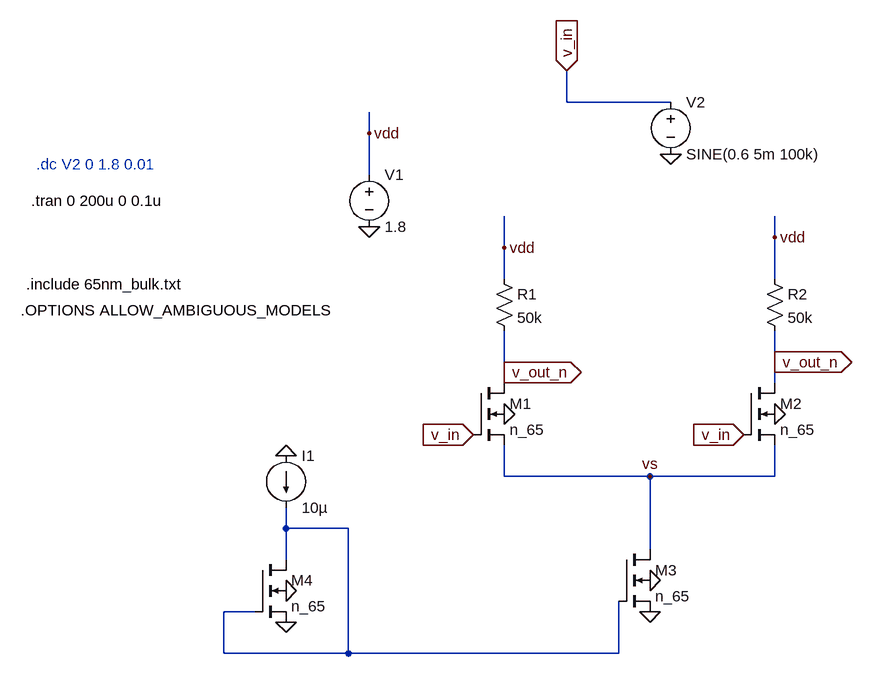
[diagram p0: schematic DiffAMPcommonmode1.asc]
DiffAMPcommonmode1.asc, the LTspice schematic file:
Version 4.1
SHEET 1 880 680
WIRE 288 -272 288 -320
WIRE 448 -272 288 -272
WIRE -16 -224 -16 -256
WIRE -16 -160 -16 -224
WIRE 608 -64 608 -96
WIRE 192 -48 192 -96
WIRE 192 0 192 -48
WIRE 608 0 608 -64
WIRE 608 128 608 80
WIRE 192 144 192 80
WIRE 192 160 192 144
WIRE 608 160 608 128
WIRE 192 304 192 256
WIRE 416 304 192 304
WIRE 608 304 608 256
WIRE 608 304 416 304
WIRE -144 384 -144 352
WIRE -48 384 -144 384
WIRE 416 416 416 304
WIRE -144 432 -144 384
WIRE -192 512 -240 512
WIRE -240 576 -240 512
WIRE -48 576 -48 384
WIRE -48 576 -240 576
WIRE 368 576 368 496
WIRE 368 576 -48 576
FLAG -144 480 0
FLAG 416 464 0
FLAG 608 208 0
FLAG 192 208 0
FLAG -16 -80 0
FLAG 416 512 0
FLAG -144 528 0
FLAG 448 -192 0
FLAG -16 -224 vdd
FLAG 192 -48 vdd
FLAG 608 -64 vdd
FLAG 144 240 v_in
IOPIN 144 240 In
FLAG 560 240 v_in
IOPIN 560 240 In
FLAG 192 144 v_out_n
IOPIN 192 144 Out
FLAG 608 128 v_out_n
IOPIN 608 128 Out
FLAG -144 272 0
FLAG 288 -320 v_in
IOPIN 288 -320 In
FLAG 416 304 vs
SYMBOL voltage -16 -176 R0
WINDOW 123 0 0 Left 0
WINDOW 39 0 0 Left 0
SYMATTR InstName V1
SYMATTR Value 1.8
SYMBOL voltage 448 -288 R0
WINDOW 123 0 0 Left 0
WINDOW 39 0 0 Left 0
SYMATTR InstName V2
SYMATTR Value SINE(0.6 5m 100k)
SYMBOL res 176 -16 R0
SYMATTR InstName R1
SYMATTR Value 50k
SYMBOL res 592 -16 R0
SYMATTR InstName R2
SYMATTR Value 50k
SYMBOL nmos4 144 160 R0
SYMATTR InstName M1
SYMATTR Value n_65
SYMATTR Value2 l=180n w=10u
SYMBOL nmos4 560 160 R0
SYMATTR InstName M2
SYMATTR Value n_65
SYMATTR Value2 l=180n w=10u
SYMBOL nmos4 368 416 R0
SYMATTR InstName M3
SYMATTR Value n_65
SYMATTR Value2 l=300n w=20u
SYMBOL nmos4 -192 432 R0
SYMATTR InstName M4
SYMATTR Value n_65
SYMATTR Value2 l=300n w=20u
SYMBOL current -144 272 R0
WINDOW 123 0 0 Left 0
WINDOW 39 0 0 Left 0
SYMATTR InstName I1
SYMATTR Value 10µ
TEXT -544 8 Left 2 !.include 65nm_bulk.txt
TEXT -552 48 Left 2 !.OPTIONS ALLOW_AMBIGUOUS_MODELS
TEXT -536 -120 Left 2 !.tran 0 200u 0 0.1u
TEXT -528 -176 Left 2 ;.dc V2 0 1.8 0.01

The netlist it stands for:
* DiffAMPcommonmode1.asc
V1 vdd 0 1.8
V2 v_in 0 SINE(0.6 5m 100k)
R1 vdd v_out_n 50k
R2 vdd v_out_n 50k
M1 v_out_n v_in vs 0 n_65 l=180n w=10u
M2 v_out_n v_in vs 0 n_65 l=180n w=10u
M3 vs N001 0 0 n_65 l=300n w=20u
M4 N001 N001 0 0 n_65 l=300n w=20u
I1 0 N001 10µ
.model NMOS NMOS
.model PMOS PMOS
.lib standard.mos
.include 65nm_bulk.txt
.OPTIONS ALLOW_AMBIGUOUS_MODELS
.tran 0 200u 0 0.1u
* .dc V2 0 1.8 0.01
.backanno
.end